# EasyEDA Pro project WirelessChargingReceive_V1.0.eprj

# Schematic WirelessChargingReceive
Create Date: 2023-05-12; Page Name: P1; Project Name: WirelessChargingReceive_V1.0; Schematic Name: WirelessChargingReceive; Update Date: 2023-05-12; Company: 嘉立创EDA; Page Size: A4; Version: V1.0
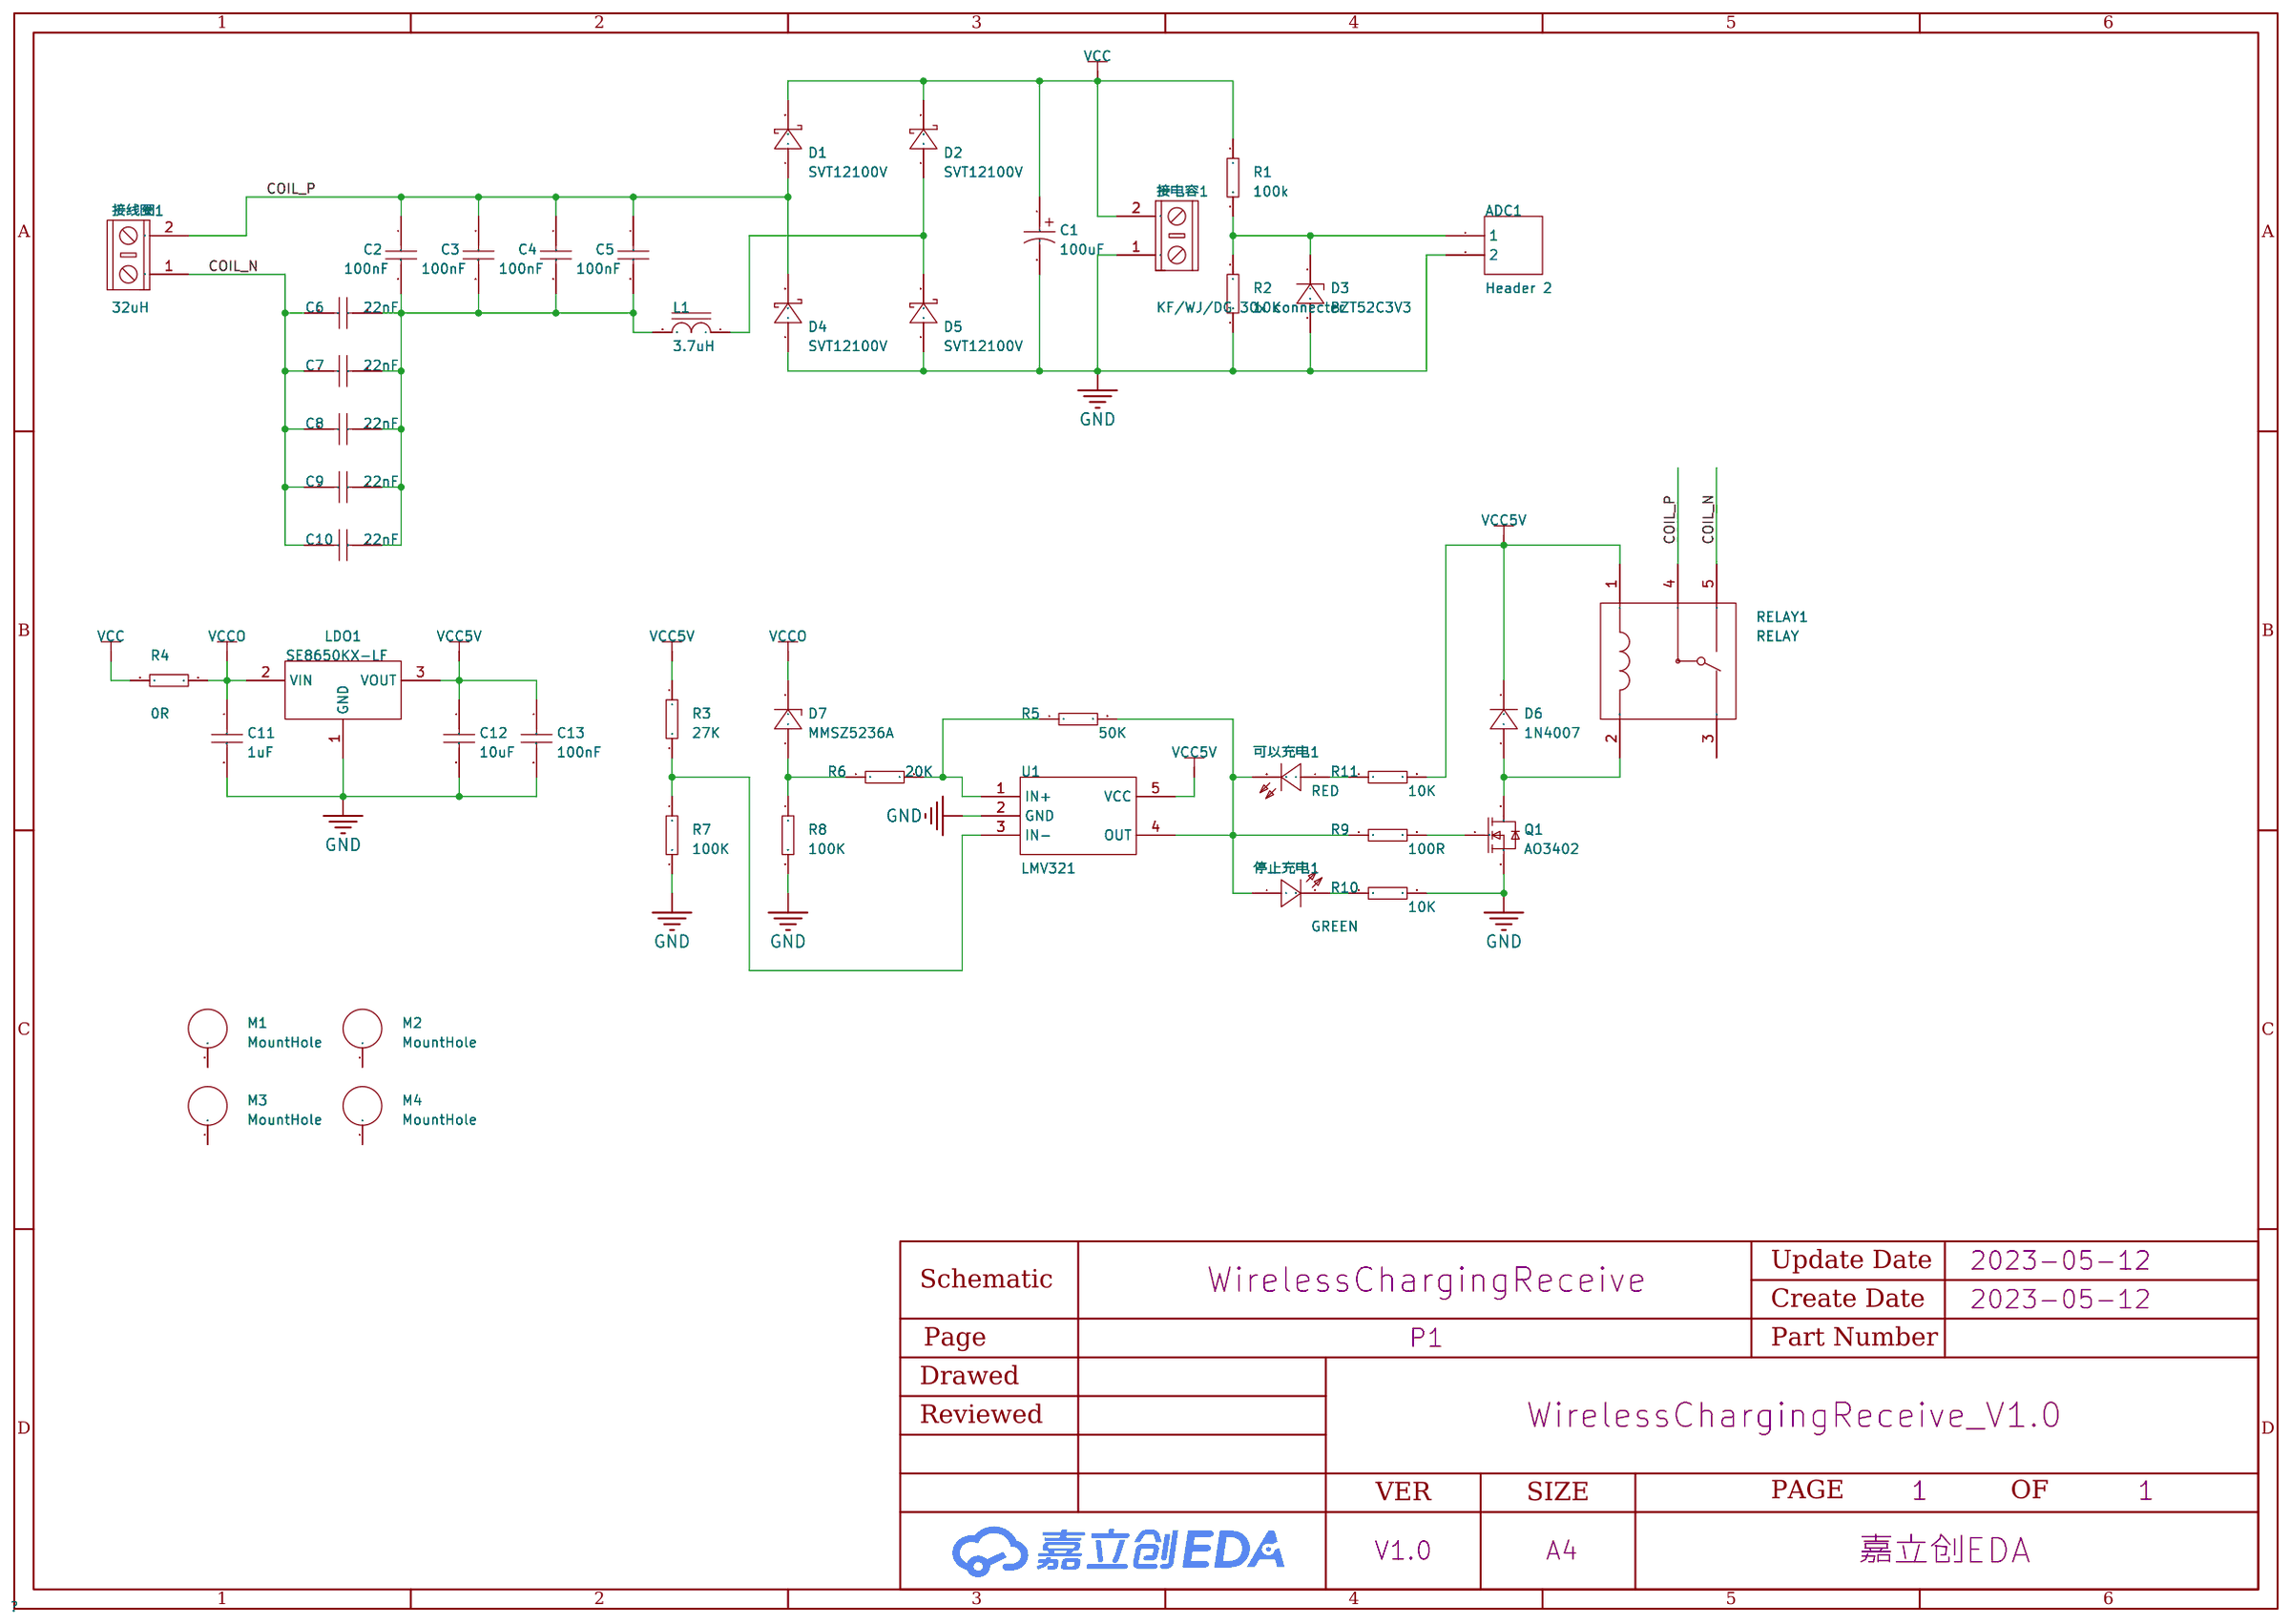
[diagram p0: schematic sheet]

## Parts
ADC1  Header 2  [HDR1X2]
C1  100uF  [CAPPR5-10X16]
C2  100nF  [CAPC3216[1206]S]
C3  100nF  [CAPC3216[1206]S]
C4  100nF  [CAPC3216[1206]S]
C5  100nF  [CAPC3216[1206]S]
C6  22nF  [CAPC3216[1206]S]
C7  22nF  [CAPC3216[1206]S]
C8  22nF  [CAPC3216[1206]S]
C9  22nF  [CAPC3216[1206]S]
C10  22nF  [CAPC3216[1206]S]
C11  1uF  [CAPC3216[1206]]
C12  10uF  [CAPC3216[1206]]
C13  100nF  [CAPC1608[0603]S-N]
D1  SVT12100V  [TO-277B]
D2  SVT12100V  [TO-277B]
D3  BZT52C3V3  [SOD-123-L]
D4  SVT12100V  [TO-277B]
D5  SVT12100V  [TO-277B]
D6  1N4007  [SOD-123-L]
D7  MMSZ5236A  [SOD-123-L]
L1  3.7uH  [T106-LAY]
LDO1  SE8650KX-LF  [SOT-89[T0243AA][SC62]]
M1  MountHole  [M3-MountHole-Plated]
M2  MountHole  [M3-MountHole-Plated]
M3  MountHole  [M3-MountHole-Plated]
M4  MountHole  [M3-MountHole-Plated]
Q1  AO3402  [SOT-23]
R1  100K  [RESC1608[0603]S-N]
R2  10K  [RESC1608[0603]S-N]
R3  27K  [RESC1608[0603]S-N]
R4  0R  [RESC1608[0603]S-N]
R5  50K  [RESC1608[0603]S-N]
R6  20K  [RESC1608[0603]S-N]
R7  100K  [RESC1608[0603]S-N]
R8  100K  [RESC1608[0603]S-N]
R9  100R  [RESC1608[0603]S-N]
R10  10K  [RESC1608[0603]S-N]
R11  10K  [RESC1608[0603]S-N]
RELAY1  RELAY  [RELAY-15x10x12]
U1  LMV321  [SOT-23-5]
停止充电1  GREEN  [LEDC1608(0603)-L]
可以充电1  RED  [LEDC1608(0603)-L]
接电容1  KF/WJ/DG 30x connecter  [KF/WJ/DG 301-2p-5.0mm]
接线圈1  32uH  [KF/WJ/DG 301-2p-5.0mm]

## Library data of the parts
ADC1 = Header 2: LatestRevisionDate: 17-Jul-2002; LatestRevisionNote: Re-released for DXP Platform.; Publisher: Altium Limited; Price(RMB): 0.00; Origin Footprint 2: PH2.0-2; Origin Footprint 3: XH2.54-2; Origin Footprint 4: GH1.25T-2P; Origin Footprint 5: XH2.54-2-L; Origin Footprint 6: XH2.54-WS-2P
C1 = Cap-Elect: Published: 8-Jun-2000; Revision: July-2002: Re-released for DXP Platform.; Publisher: Altium Limited; Price(RMB): 0.000; Voltage: 100V; Origin Footprint 2: CAPPR2-4x6.8; Origin Footprint 3: CAPPR2-5X5; Origin Footprint 4: CAPPR2-5X6.8; Origin Footprint 5: CAPPR2-5X7; Origin Footprint 6: CAPPR2-5X11; Origin Footprint 7: CAPPR2-5X11.5; Origin Footprint 8: CAPPR2-5X15; Origin Footprint 9: CAPPR2.5-6.3X5; Origin Footprint 10: CAPPR2.5-6.3X5/h.9; Origin Footprint 11: CAPPR2.5-6.3X6.8; Origin Footprint 12: CAPPR2.5-6.3X6.8/h.9; Origin Footprint 13: CAPPR2.5-6.3X7; Origin Footprint 14: CAPPR2.5-6.3X11; Origin Footprint 15: CAPPR2.5-6.3X11.5; Origin Footprint 16: CAPPR2.5-6.3X15; Origin Footprint 17: CAPPR2.5-6.3x9.8; Origin Footprint 18: CAPPR2.5-8X9.8; Origin Footprint 19: CAPPR2.5-8X11; Origin Footprint 20: CAPPR2.5-8x5; Origin Footprint 21: CAPPR3.05-3.81X6.35; Origin Footprint 22: CAPPR3.5-8X5/h.9; Origin Footprint 23: CAPPR3.5-8X10.5; Origin Footprint 24: CAPPR3.5-8X11.5; Origin Footprint 25: CAPPR3.5-8X12; Origin Footprint 26: CAPPR3.5-8X15; Origin Footprint 27: CAPPR3.5-8X20; Origin Footprint 28: CAPPR3.5-8x5; Origin Footprint 29: CAPPR5-8X5; Origin Footprint 30: CAPPR5-8X11.5; Origin Footprint 31: CAPPR5-8X12; Origin Footprint 32: CAPPR5-8X15; Origin Footprint 33: CAPPR5-8X20; Origin Footprint 34: CAPPR5-10X5/H.9; Origin Footprint 35: CAPPR5-10X10.5; Origin Footprint 36: CAPPR5-10X12.5; Origin Footprint 37: CAPPR5-10X20/H1.1; Origin Footprint 38: CAPPR5-10X25; Origin Footprint 39: CAPPR5-10X30; Origin Footprint 40: CAPPR5-10x5; Origin Footprint 41: CAPPR5-10x20; Origin Footprint 42: CAPPR2.5-6.3X6.8-L; Origin Footprint 43: CAPPR7.5-16X31.5; Origin Footprint 44: CAPPR7.5-16x25; Origin Footprint 45: CAPPR7.5-18x35.5
C2-C5 = Cap-Chip_1: Published: 2020-12-18; Revision: V1.1; Tolerance: ±10%; Voltage: 100V; Origin Footprint 2: CAPC1310[0504]S; Origin Footprint 3: CAPC3225[1210]S; Origin Footprint 4: CAPC4532[1812]S; Origin Footprint 5: CAPC4564[1825]S; Origin Footprint 6: CAPC2012[0805]; Origin Footprint 7: CAPC3216[1206]; Origin Footprint 8: CAPC3225[1210]; Origin Footprint 9: CAPC4532[1812]; Origin Footprint 10: CAPC4564[1825]; Origin Footprint 11: CAPC1608[0603]-N; Origin Footprint 12: CAPC1608[0603]-L; Origin Footprint 13: CAPC1608[0603]-M; Origin Footprint 14: CAPC1608[0603]S-L; Origin Footprint 15: CAPC1608[0603]S-M; Origin Footprint 16: CAPC1608[0603]S-N; Origin Footprint 17: CAPC1005[0402]-L; Origin Footprint 18: CAPC1005[0402]-M; Origin Footprint 19: CAPC1005[0402]-N; Origin Footprint 20: CAPC1005[0402]S-L; Origin Footprint 21: CAPC1005[0402]S-M; Origin Footprint 22: CAPC1005[0402]S-N; Origin Footprint 23: CAPC2012[0805]S-L; Origin Footprint 24: CAPC2012[0805]S-M; Origin Footprint 25: CAPC2012[0805]S-N
C6-C10 = Cap-Chip: Published: 2020-12-18; Revision: V1.1; Tolerance: ±10%; Voltage: 100V; Origin Footprint 2: CAPC1310[0504]S; Origin Footprint 3: CAPC3225[1210]S; Origin Footprint 4: CAPC4532[1812]S; Origin Footprint 5: CAPC4564[1825]S; Origin Footprint 6: CAPC2012[0805]; Origin Footprint 7: CAPC3216[1206]; Origin Footprint 8: CAPC3225[1210]; Origin Footprint 9: CAPC4532[1812]; Origin Footprint 10: CAPC4564[1825]; Origin Footprint 11: CAPC1608[0603]-N; Origin Footprint 12: CAPC1608[0603]-L; Origin Footprint 13: CAPC1608[0603]-M; Origin Footprint 14: CAPC1608[0603]S-L; Origin Footprint 15: CAPC1608[0603]S-M; Origin Footprint 16: CAPC1608[0603]S-N; Origin Footprint 17: CAPC1005[0402]-L; Origin Footprint 18: CAPC1005[0402]-M; Origin Footprint 19: CAPC1005[0402]-N; Origin Footprint 20: CAPC1005[0402]S-L; Origin Footprint 21: CAPC1005[0402]S-M; Origin Footprint 22: CAPC1005[0402]S-N; Origin Footprint 23: CAPC2012[0805]S-L; Origin Footprint 24: CAPC2012[0805]S-M; Origin Footprint 25: CAPC2012[0805]S-N
C11 = Cap-Chip_2: Published: 2020-12-18; Revision: V1.1; Tolerance: ±10%; Voltage: 100V; Origin Footprint 2: CAPC1310[0504]S; Origin Footprint 3: CAPC3216[1206]S; Origin Footprint 4: CAPC3225[1210]S; Origin Footprint 5: CAPC4532[1812]S; Origin Footprint 6: CAPC4564[1825]S; Origin Footprint 7: CAPC2012[0805]; Origin Footprint 8: CAPC3225[1210]; Origin Footprint 9: CAPC4532[1812]; Origin Footprint 10: CAPC4564[1825]; Origin Footprint 11: CAPC1608[0603]-N; Origin Footprint 12: CAPC1608[0603]-L; Origin Footprint 13: CAPC1608[0603]-M; Origin Footprint 14: CAPC1608[0603]S-L; Origin Footprint 15: CAPC1608[0603]S-M; Origin Footprint 16: CAPC1608[0603]S-N; Origin Footprint 17: CAPC1005[0402]-L; Origin Footprint 18: CAPC1005[0402]-M; Origin Footprint 19: CAPC1005[0402]-N; Origin Footprint 20: CAPC1005[0402]S-L; Origin Footprint 21: CAPC1005[0402]S-M; Origin Footprint 22: CAPC1005[0402]S-N; Origin Footprint 23: CAPC2012[0805]S-L; Origin Footprint 24: CAPC2012[0805]S-M; Origin Footprint 25: CAPC2012[0805]S-N
C12 = Cap-Chip_3: Published: 2020-12-18; Revision: V1.1; Tolerance: ±10%; Voltage: 25V; Origin Footprint 2: CAPC1310[0504]S; Origin Footprint 3: CAPC3216[1206]S; Origin Footprint 4: CAPC3225[1210]S; Origin Footprint 5: CAPC4532[1812]S; Origin Footprint 6: CAPC4564[1825]S; Origin Footprint 7: CAPC2012[0805]; Origin Footprint 8: CAPC3225[1210]; Origin Footprint 9: CAPC4532[1812]; Origin Footprint 10: CAPC4564[1825]; Origin Footprint 11: CAPC1608[0603]-N; Origin Footprint 12: CAPC1608[0603]-L; Origin Footprint 13: CAPC1608[0603]-M; Origin Footprint 14: CAPC1608[0603]S-L; Origin Footprint 15: CAPC1608[0603]S-M; Origin Footprint 16: CAPC1608[0603]S-N; Origin Footprint 17: CAPC1005[0402]-L; Origin Footprint 18: CAPC1005[0402]-M; Origin Footprint 19: CAPC1005[0402]-N; Origin Footprint 20: CAPC1005[0402]S-L; Origin Footprint 21: CAPC1005[0402]S-M; Origin Footprint 22: CAPC1005[0402]S-N; Origin Footprint 23: CAPC2012[0805]S-L; Origin Footprint 24: CAPC2012[0805]S-M; Origin Footprint 25: CAPC2012[0805]S-N
C13 = Cap-Chip_4: Published: 2020-12-18; Revision: V1.1; Tolerance: ±10%; Voltage: 50V; Origin Footprint 2: CAPC1310[0504]S; Origin Footprint 3: CAPC3216[1206]S; Origin Footprint 4: CAPC3225[1210]S; Origin Footprint 5: CAPC4532[1812]S; Origin Footprint 6: CAPC4564[1825]S; Origin Footprint 7: CAPC2012[0805]; Origin Footprint 8: CAPC3216[1206]; Origin Footprint 9: CAPC3225[1210]; Origin Footprint 10: CAPC4532[1812]; Origin Footprint 11: CAPC4564[1825]; Origin Footprint 12: CAPC1608[0603]-N; Origin Footprint 13: CAPC1608[0603]-L; Origin Footprint 14: CAPC1608[0603]-M; Origin Footprint 15: CAPC1608[0603]S-L; Origin Footprint 16: CAPC1608[0603]S-M; Origin Footprint 17: CAPC1005[0402]-L; Origin Footprint 18: CAPC1005[0402]-M; Origin Footprint 19: CAPC1005[0402]-N; Origin Footprint 20: CAPC1005[0402]S-L; Origin Footprint 21: CAPC1005[0402]S-M; Origin Footprint 22: CAPC1005[0402]S-N; Origin Footprint 23: CAPC2012[0805]S-L; Origin Footprint 24: CAPC2012[0805]S-M; Origin Footprint 25: CAPC2012[0805]S-N
D1 D2 D4 D5 = FM10U100: Revision: V1.0.0
D3 = Diode Zen: Published: 8-Jun-2000; Revision: July-2002: Re-released for DXP Platform.; Publisher: Altium Limited; Price(RMB): 0.000; Origin Footprint 2: DIODE-0.7; Origin Footprint 3: DIODE-0.4; Origin Footprint 4: SOD-87[LL-41]; Origin Footprint 5: CD4521-1808; Origin Footprint 6: SOD-80[LL-34]; Origin Footprint 7: SOD-123-FL; Origin Footprint 8: SOD-123-M; Origin Footprint 9: SOD-323; Origin Footprint 10: SOD-523-L; Origin Footprint 11: SOD-523-M
D6 = Diode: Published: 8-Jun-2000; Revision: July-2002: Re-released for DXP Platform.; Publisher: Altium Limited; Price(RMB): 0.000; Imax: 500mA; Origin Footprint 2: SMB[DO-214AA]; Origin Footprint 3: SMC[DO-214AB]; Origin Footprint 4: SMA[DO-214AC]; Origin Footprint 5: SOD-123-FL; Origin Footprint 6: SOD-123-M; Origin Footprint 7: SOD-323; Origin Footprint 8: SOD-523-L; Origin Footprint 9: SOD-523-M
D7 = Diode Zen_1: Published: 8-Jun-2000; Revision: July-2002: Re-released for DXP Platform.; Publisher: Altium Limited; Price(RMB): 0.000; Origin Footprint 2: DIODE-0.7; Origin Footprint 3: DIODE-0.4; Origin Footprint 4: SOD-87[LL-41]; Origin Footprint 5: CD4521-1808; Origin Footprint 6: SOD-80[LL-34]; Origin Footprint 7: SOD-123-FL; Origin Footprint 8: SOD-123-M; Origin Footprint 9: SOD-323; Origin Footprint 10: SOD-523-L; Origin Footprint 11: SOD-523-M
L1 = Ind-Power: Published: 8-Jun-2000; Revision: July-2002: Re-released for DXP Platform.; Publisher: Altium Limited; Imax: 50mA; DCR: .5m; Price(RMB): 0.000; Origin Footprint 2: CD31; Origin Footprint 3: CD32; Origin Footprint 4: CD42; Origin Footprint 5: CD43; Origin Footprint 6: CD52; Origin Footprint 7: CD53; Origin Footprint 8: CD54; Origin Footprint 9: CD73; Origin Footprint 10: CD75; Origin Footprint 11: CD104; Origin Footprint 12: CD105; Origin Footprint 13: CD106; Origin Footprint 14: 127 Shielded 12.5*12.5*7; Origin Footprint 15: 0630 TPC 7*7*3; Origin Footprint 16: 1050 TPC 10*10*5; Origin Footprint 17: 1265 TPC 12*12*6.5; Origin Footprint 18: CD104R; Origin Footprint 19: SLO2520; Origin Footprint 20: 1365 TPC 13*13*6.5; Origin Footprint 21: INDUCTOR; Origin Footprint 22: T94-LAY
LDO1 = SE86XXKX-LF
M1-M4 = MountHole: Origin Footprint 2: M3-MountHole; Origin Footprint 3: M3-MountSlot; Origin Footprint 4: M3-MountSlot-Plated; Origin Footprint 5: M3-MountHole-4mm; Origin Footprint 6: M3-MountHole-5mm; Origin Footprint 7: M3-MountHole-6mm; Origin Footprint 8: M3-MountHole-7mm; Origin Footprint 9: M3-MountHole-8mm; Origin Footprint 10: M3-MountHole-9mm; Origin Footprint 11: M3-MountHole-10mm; Origin Footprint 12: M3-MountHole-11mm; Origin Footprint 13: M3-MountHole-12mm; Origin Footprint 14: M3-MountHole-13mm; Origin Footprint 15: M3-MountHole-14mm; Origin Footprint 16: M3-MountHole-15mm; Origin Footprint 17: M3-MountHole-16mm; Origin Footprint 18: M3-MountHole-17mm; Origin Footprint 19: M3-MountHole-18mm; Origin Footprint 20: M3-MountHole-19mm; Origin Footprint 21: M3-MountHole-20mm; Origin Footprint 22: M3-MountHole-Plated-4MM; Origin Footprint 23: M3-MountHole-Plated-5MM; Origin Footprint 24: M3-MountHole-Plated-6MM; Origin Footprint 25: M3-MountHole-Plated-7MM; Origin Footprint 26: M3-MountHole-Plated-8MM; Origin Footprint 27: M3-MountHole-Plated-9MM; Origin Footprint 28: M3-MountHole-Plated-10MM; Origin Footprint 29: M3-MountHole-Plated-11MM; Origin Footprint 30: M3-MountHole-Plated-12MM; Origin Footprint 31: M3-MountHole-Plated-13MM; Origin Footprint 32: M3-MountHole-Plated-14MM; Origin Footprint 33: M3-MountHole-Plated-15MM; Origin Footprint 34: M3-MountHole-Plated-16MM; Origin Footprint 35: M3-MountHole-Plated-17MM; Origin Footprint 36: M3-MountHole-Plated-18MM; Origin Footprint 37: M3-MountHole-Plated-19MM; Origin Footprint 38: M3-MountHole-Plated-20MM
Q1 = AO3400
R1 R7 R8 = Res-Chip: Published: 8-Jun-2000; Revision: July-2002: Re-released for DXP Platform.; Tolerance: ±1%; Origin Footprint 2: RESC3225[1210]S; Origin Footprint 3: RESC5025[2010]S; Origin Footprint 4: RESC6332[2512]S; Origin Footprint 5: RESC5025[2010]; Origin Footprint 6: RESC6332[2512]; Origin Footprint 7: RESC3225[1210]; Origin Footprint 8: RESC3216[1206]; Origin Footprint 9: RESC2012[0805]; Origin Footprint 10: RESC1608[0603]-M; Origin Footprint 11: RESC1608[0603]-L; Origin Footprint 12: RESC1608[0603]-N; Origin Footprint 13: RESC1608[0603]S-L; Origin Footprint 14: RESC1608[0603]S-M; Origin Footprint 15: RESC1005[0402]-L; Origin Footprint 16: RESC1005[0402]-N; Origin Footprint 17: RESC1005[0402]-M; Origin Footprint 18: RESC1005[0402]S-L; Origin Footprint 19: RESC1005[0402]S-M; Origin Footprint 20: RESC1005[0402]S-N; Origin Footprint 21: RESC2012[0805]S-L; Origin Footprint 22: RESC2012[0805]S-M; Origin Footprint 23: RESC2012[0805]S-N; Origin Footprint 24: RESC3216[1206]S-L; Origin Footprint 25: RESC3216[1206]S-M; Origin Footprint 26: RESC3216[1206]S-N
R2 R10 R11 = Res-Chip_1: Published: 8-Jun-2000; Revision: July-2002: Re-released for DXP Platform.; Tolerance: ±1%; Origin Footprint 2: RESC3225[1210]S; Origin Footprint 3: RESC5025[2010]S; Origin Footprint 4: RESC6332[2512]S; Origin Footprint 5: RESC5025[2010]; Origin Footprint 6: RESC6332[2512]; Origin Footprint 7: RESC3225[1210]; Origin Footprint 8: RESC3216[1206]; Origin Footprint 9: RESC2012[0805]; Origin Footprint 10: RESC1608[0603]-M; Origin Footprint 11: RESC1608[0603]-L; Origin Footprint 12: RESC1608[0603]-N; Origin Footprint 13: RESC1608[0603]S-L; Origin Footprint 14: RESC1608[0603]S-M; Origin Footprint 15: RESC1005[0402]-L; Origin Footprint 16: RESC1005[0402]-N; Origin Footprint 17: RESC1005[0402]-M; Origin Footprint 18: RESC1005[0402]S-L; Origin Footprint 19: RESC1005[0402]S-M; Origin Footprint 20: RESC1005[0402]S-N; Origin Footprint 21: RESC2012[0805]S-L; Origin Footprint 22: RESC2012[0805]S-M; Origin Footprint 23: RESC2012[0805]S-N; Origin Footprint 24: RESC3216[1206]S-L; Origin Footprint 25: RESC3216[1206]S-M; Origin Footprint 26: RESC3216[1206]S-N
R3 = Res-Chip_4: Published: 8-Jun-2000; Revision: July-2002: Re-released for DXP Platform.; Tolerance: ±1%; Origin Footprint 2: RESC3225[1210]S; Origin Footprint 3: RESC5025[2010]S; Origin Footprint 4: RESC6332[2512]S; Origin Footprint 5: RESC5025[2010]; Origin Footprint 6: RESC6332[2512]; Origin Footprint 7: RESC3225[1210]; Origin Footprint 8: RESC3216[1206]; Origin Footprint 9: RESC2012[0805]; Origin Footprint 10: RESC1608[0603]-M; Origin Footprint 11: RESC1608[0603]-L; Origin Footprint 12: RESC1608[0603]-N; Origin Footprint 13: RESC1608[0603]S-L; Origin Footprint 14: RESC1608[0603]S-M; Origin Footprint 15: RESC1005[0402]-L; Origin Footprint 16: RESC1005[0402]-N; Origin Footprint 17: RESC1005[0402]-M; Origin Footprint 18: RESC1005[0402]S-L; Origin Footprint 19: RESC1005[0402]S-M; Origin Footprint 20: RESC1005[0402]S-N; Origin Footprint 21: RESC2012[0805]S-L; Origin Footprint 22: RESC2012[0805]S-M; Origin Footprint 23: RESC2012[0805]S-N; Origin Footprint 24: RESC3216[1206]S-L; Origin Footprint 25: RESC3216[1206]S-M; Origin Footprint 26: RESC3216[1206]S-N
R4 = Res-Chip_6: Published: 8-Jun-2000; Revision: July-2002: Re-released for DXP Platform.; Tolerance: ±1%; Origin Footprint 2: RESC3225[1210]S; Origin Footprint 3: RESC5025[2010]S; Origin Footprint 4: RESC6332[2512]S; Origin Footprint 5: RESC5025[2010]; Origin Footprint 6: RESC6332[2512]; Origin Footprint 7: RESC3225[1210]; Origin Footprint 8: RESC3216[1206]; Origin Footprint 9: RESC2012[0805]; Origin Footprint 10: RESC1608[0603]-M; Origin Footprint 11: RESC1608[0603]-L; Origin Footprint 12: RESC1608[0603]-N; Origin Footprint 13: RESC1608[0603]S-L; Origin Footprint 14: RESC1608[0603]S-M; Origin Footprint 15: RESC1005[0402]-L; Origin Footprint 16: RESC1005[0402]-N; Origin Footprint 17: RESC1005[0402]-M; Origin Footprint 18: RESC1005[0402]S-L; Origin Footprint 19: RESC1005[0402]S-M; Origin Footprint 20: RESC1005[0402]S-N; Origin Footprint 21: RESC2012[0805]S-L; Origin Footprint 22: RESC2012[0805]S-M; Origin Footprint 23: RESC2012[0805]S-N; Origin Footprint 24: RESC3216[1206]S-L; Origin Footprint 25: RESC3216[1206]S-M; Origin Footprint 26: RESC3216[1206]S-N
R5 = Res-Chip_3: Published: 8-Jun-2000; Revision: July-2002: Re-released for DXP Platform.; Tolerance: ±1%; Origin Footprint 2: RESC3225[1210]S; Origin Footprint 3: RESC5025[2010]S; Origin Footprint 4: RESC6332[2512]S; Origin Footprint 5: RESC5025[2010]; Origin Footprint 6: RESC6332[2512]; Origin Footprint 7: RESC3225[1210]; Origin Footprint 8: RESC3216[1206]; Origin Footprint 9: RESC2012[0805]; Origin Footprint 10: RESC1608[0603]-M; Origin Footprint 11: RESC1608[0603]-L; Origin Footprint 12: RESC1608[0603]-N; Origin Footprint 13: RESC1608[0603]S-L; Origin Footprint 14: RESC1608[0603]S-M; Origin Footprint 15: RESC1005[0402]-L; Origin Footprint 16: RESC1005[0402]-N; Origin Footprint 17: RESC1005[0402]-M; Origin Footprint 18: RESC1005[0402]S-L; Origin Footprint 19: RESC1005[0402]S-M; Origin Footprint 20: RESC1005[0402]S-N; Origin Footprint 21: RESC2012[0805]S-L; Origin Footprint 22: RESC2012[0805]S-M; Origin Footprint 23: RESC2012[0805]S-N; Origin Footprint 24: RESC3216[1206]S-L; Origin Footprint 25: RESC3216[1206]S-M; Origin Footprint 26: RESC3216[1206]S-N
R6 = Res-Chip_2: Published: 8-Jun-2000; Revision: July-2002: Re-released for DXP Platform.; Tolerance: ±1%; Origin Footprint 2: RESC3225[1210]S; Origin Footprint 3: RESC5025[2010]S; Origin Footprint 4: RESC6332[2512]S; Origin Footprint 5: RESC5025[2010]; Origin Footprint 6: RESC6332[2512]; Origin Footprint 7: RESC3225[1210]; Origin Footprint 8: RESC3216[1206]; Origin Footprint 9: RESC2012[0805]; Origin Footprint 10: RESC1608[0603]-M; Origin Footprint 11: RESC1608[0603]-L; Origin Footprint 12: RESC1608[0603]-N; Origin Footprint 13: RESC1608[0603]S-L; Origin Footprint 14: RESC1608[0603]S-M; Origin Footprint 15: RESC1005[0402]-L; Origin Footprint 16: RESC1005[0402]-N; Origin Footprint 17: RESC1005[0402]-M; Origin Footprint 18: RESC1005[0402]S-L; Origin Footprint 19: RESC1005[0402]S-M; Origin Footprint 20: RESC1005[0402]S-N; Origin Footprint 21: RESC2012[0805]S-L; Origin Footprint 22: RESC2012[0805]S-M; Origin Footprint 23: RESC2012[0805]S-N; Origin Footprint 24: RESC3216[1206]S-L; Origin Footprint 25: RESC3216[1206]S-M; Origin Footprint 26: RESC3216[1206]S-N
R9 = Res-Chip_5: Published: 8-Jun-2000; Revision: July-2002: Re-released for DXP Platform.; Tolerance: ±1%; Origin Footprint 2: RESC3225[1210]S; Origin Footprint 3: RESC5025[2010]S; Origin Footprint 4: RESC6332[2512]S; Origin Footprint 5: RESC5025[2010]; Origin Footprint 6: RESC6332[2512]; Origin Footprint 7: RESC3225[1210]; Origin Footprint 8: RESC3216[1206]; Origin Footprint 9: RESC2012[0805]; Origin Footprint 10: RESC1608[0603]-M; Origin Footprint 11: RESC1608[0603]-L; Origin Footprint 12: RESC1608[0603]-N; Origin Footprint 13: RESC1608[0603]S-L; Origin Footprint 14: RESC1608[0603]S-M; Origin Footprint 15: RESC1005[0402]-L; Origin Footprint 16: RESC1005[0402]-N; Origin Footprint 17: RESC1005[0402]-M; Origin Footprint 18: RESC1005[0402]S-L; Origin Footprint 19: RESC1005[0402]S-M; Origin Footprint 20: RESC1005[0402]S-N; Origin Footprint 21: RESC2012[0805]S-L; Origin Footprint 22: RESC2012[0805]S-M; Origin Footprint 23: RESC2012[0805]S-N; Origin Footprint 24: RESC3216[1206]S-L; Origin Footprint 25: RESC3216[1206]S-M; Origin Footprint 26: RESC3216[1206]S-N
RELAY1 = RELAY: Origin Footprint 2: RELAY-19x16x16
U1 = LM321
停止充电1 = LED Chip Green: Published: 8-Jun-2000; Revision: July-2002: Re-released for DXP Platform.; Publisher: Altium Limited; Price(RMB): 0.00; Origin Footprint 2: LEDC1608(0603); Origin Footprint 3: LEDC2012(0805); Origin Footprint 4: LEDC3216(1206); Origin Footprint 5: LEDC2012(0805)-L; Origin Footprint 6: LEDC3216(1204); Origin Footprint 7: LEDC3528-2
可以充电1 = LED Chip Red: Published: 8-Jun-2000; Revision: July-2002: Re-released for DXP Platform.; Publisher: Altium Limited; Price(RMB): 0.00; Origin Footprint 2: LEDC1608(0603); Origin Footprint 3: LEDC2012(0805); Origin Footprint 4: LEDC3216(1206); Origin Footprint 5: LEDC2012(0805)-L; Origin Footprint 6: LEDC3216(1204); Origin Footprint 7: LEDC3528-2
接电容1 接线圈1 = KF/WJ/DG 30x

## Nets
GND: ADC1.2 C1.2 C11.2 C12.2 C13.2 D3.A D4.1 D5.1 LDO1.1(GND) Q1.2(S) R2.2 R7.2 R8.2 R10.2 U1.2(GND) 接电容1.1
VCC: C1.1 D1.2 D2.2 R1.1 R4.1 接电容1.2
VCC5V: C12.1 C13.1 D6.K LDO1.3(VOUT) R3.1 R11.2 RELAY1.1 U1.5(VCC)
VCCO: C11.1 D7.K LDO1.2(VIN) R4.2
COIL_N: C6.1 C7.1 C8.1 C9.1 C10.1 RELAY1.5 接线圈1.1
COIL_P: C2.1 C3.1 C4.1 C5.1 D1.1 D4.2 RELAY1.4 接线圈1.2
$1N2840: D7.A R6.1 R8.1
$1N3019: R3.2 R7.1 U1.3(IN-)
$1N3054: R5.1 R6.2 U1.1(IN+)
$1N3707: Q1.1(G) R9.2
$1N4256: C2.2 C3.2 C4.2 C5.2 C6.2 C7.2 C8.2 C9.2 C10.2 L1.2
$1N4259: D2.1 D5.2 L1.1
Net-(ADC1-1): ADC1.1 D3.K R1.2 R2.1
Net-(D6-A): D6.A Q1.3(D) RELAY1.2
Net-(R5-2): R5.2 R9.1 U1.4(OUT) 停止充电1.A 可以充电1.C
Net-(R10-1): R10.1 停止充电1.C
Net-(R11-1): R11.1 可以充电1.A

Not connected (* = marked no-connect by the designer): M1 1; M2 1; M3 1; M4 1; RELAY1 3

# Board WirelessChargingReceive
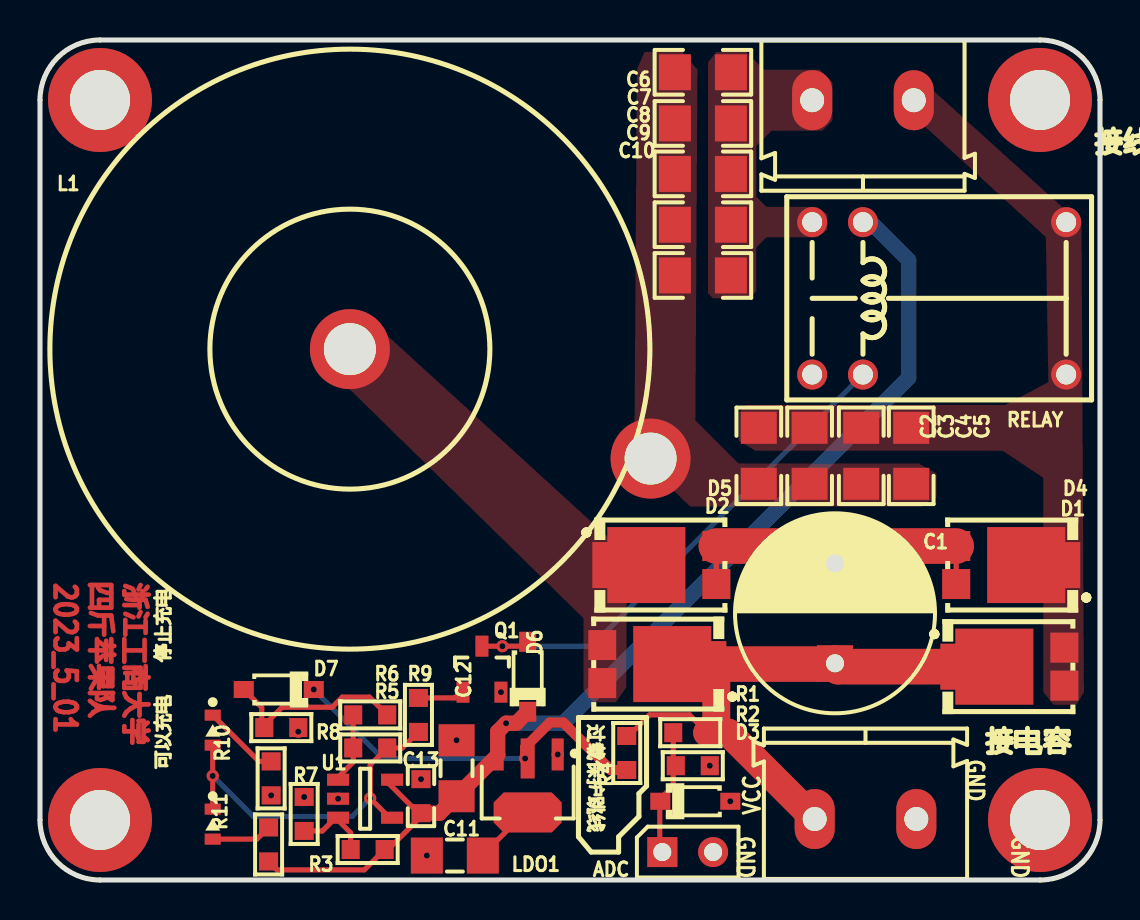
[diagram p1: board, top side]
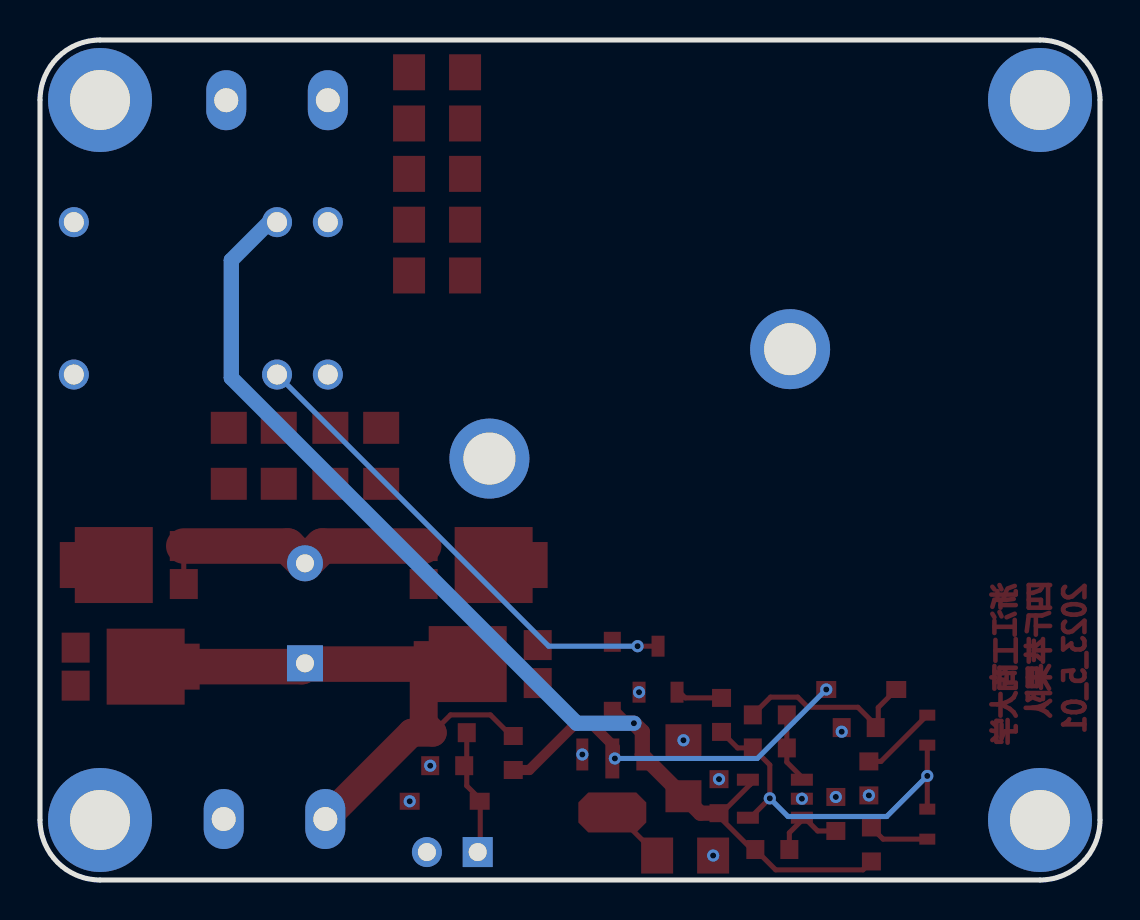
[diagram p2: board, bottom side, seen from below]

Outline 53 x 42 mm; copper layers: Top Layer, Bottom Layer. Coordinates in mm from the lower left corner of the outline.
Outline path: 0,39 0,3 arc(0.88,0.88) 3,0 50,0 arc(52.12,0.88) 53,3 53,39 arc(52.12,41.12) 50,42 3,42 arc(0.88,41.12) 0,39
Stack: Top Layer 0.035mm / Dielectric1 1.51mm FR4 er 4.5 / Bottom Layer 0.035mm

## Design rules (mm)
template: JLCPCB Capability(Two Layers Board)
spacing copperThickness1oz (default): track to track 0.102, other pairs 0.152 to 0.3
spacing copperThickness2oz: track to track 0.203, other pairs 0.152 to 0.3
track width copperThickness1oz (default): min 0.127, default 0.254, max 2.54
track width copperThickness2oz: min 0.203, default 0.254, max 2.54
differential pair differentialPair (default): width min 0.127, default 0.254, max 2.54; gap min 0.152, default 0.152
via viaSize (default): diameter min 0.5, default 0.61, max 10; hole min 0.3, default 0.305, max 6.3

## Placement (name value [footprint] x y rotation side)
ADC  Header 2  [HDR1X2]  31.12 1.4 0 top
C1  100uF  [CAPPR5-10X16]  39.75 13.33 90 top
C2  100nF  [CAPC3216[1206]S]  35.94 21.21 270 top
C3  100nF  [CAPC3216[1206]S]  38.48 21.21 270 top
C4  100nF  [CAPC3216[1206]S]  41.06 21.21 270 top
C5  100nF  [CAPC3216[1206]S]  43.56 21.21 270 top
C6  22nF  [CAPC3216[1206]S]  33.15 40.39 180 top
C7  22nF  [CAPC3216[1206]S]  33.15 37.83 180 top
C8  22nF  [CAPC3216[1206]S]  33.15 35.31 180 top
C9  22nF  [CAPC3216[1206]S]  33.15 32.77 180 top
C10  22nF  [CAPC3216[1206]S]  33.15 30.23 180 top
C11  1uF  [CAPC3216[1206]]  20.74 1.22 180 top
C12  10uF  [CAPC3216[1206]]  20.83 5.59 90 top
C13  100nF  [CAPC1608[0603]S-N]  19.05 4.19 90 top
D1  SVT12100V  [TO-277B]  47.12 10.67 0 top
D2  SVT12100V  [TO-277B]  32.21 10.8 180 top
D3  BZT52C3V3  [SOD-123-L]  32.77 3.94 180 top
D4  SVT12100V  [TO-277B]  49.91 15.75 180 top
D5  SVT12100V  [TO-277B]  29.72 15.75 0 top
D6  1N4007  [SOD-123-L]  24.38 10.16 270 top
D7  MMSZ5236A  [SOD-123-L]  11.94 9.53 0 top
L1  3.7uH  [T106-LAY]  15.49 26.54 340 top
LDO1  SE8650KX-LF  [SOT-89[T0243AA][SC62]]  24.38 4.83 270 top
M1  MountHole  [M3-MountHole-Plated]  3 39 0 top
M2  MountHole  [M3-MountHole-Plated]  3 3 0 top
M3  MountHole  [M3-MountHole-Plated]  50 3 0 top
M4  MountHole  [M3-MountHole-Plated]  50 39 0 top
Q1  AO3402  [SOT-23]  22.1 10.54 90 top
R1  100K  [RESC1608[0603]S-N]  32.51 7.37 180 top
R2  10K  [RESC1608[0603]S-N]  32.64 5.72 0 top
R3  27K  [RESC1608[0603]S-N]  16.38 1.52 180 top
R4  0R  [RESC1608[0603]S-N]  29.34 6.35 270 top
R5  50K  [RESC1608[0603]S-N]  16.51 6.6 0 top
R6  20K  [RESC1608[0603]S-N]  16.51 8.25 180 top
R7  100K  [RESC1608[0603]S-N]  13.21 3.3 90 top
R8  100K  [RESC1608[0603]S-N]  12.06 7.62 0 top
R9  100R  [RESC1608[0603]S-N]  18.92 8.25 90 top
R10  10K  [RESC1608[0603]S-N]  11.56 5.08 270 top
R11  10K  [RESC1608[0603]S-N]  11.43 1.78 270 top
RELAY  RELAY  [RELAY-15x10x12]  44.96 29.08 0 top
U1  LMV321  [SOT-23-5]  16.26 4.06 0 top
停止充电  GREEN  [LEDC1608(0603)-L]  8.64 7.49 270 top
可以充电  RED  [LEDC1608(0603)-L]  8.64 2.79 270 top
接电容  KF/WJ/DG 30x connecter  [KF/WJ/DG 301-2p-5.0mm]  41.28 3.05 0 top
接线圈  32uH  [KF/WJ/DG 301-2p-5.0mm]  41.15 38.99 180 top

## Footprints (pads in the part's own frame, mm; a bottom-side part is the same pattern mirrored in y, then rotated)
CAPC1608[0603]S-N
  rect 0.9x0.95 smd: 1(-0.85,0) 2(0.85,0)
CAPC3216[1206]
  rect 1.6x1.8 smd: 1(-1.4,0) 2(1.4,0)
CAPC3216[1206]S
  rect 1.6x1.8 smd: 1(-1.4,0) 2(1.4,0)
CAPPR5-10X16
  rect 1.8x1.8 hole 0.9: 1(-2.5,0)
  round 1.8 hole 0.9: 2(2.5,0)
HDR1X2
  rect 1.5x1.5 hole 0.9: 1(0,0)
  round 1.5 hole 0.9: 2(2.54,0)
KF/WJ/DG 301-2p-5.0mm
  oval 2x3 hole 1.2: 1(2.54,0) 2(-2.54,0)
LEDC1608(0603)-L
  rect 0.55x0.8 smd: A(0.75,0) C(-0.75,0)
M3-MountHole-Plated
  round 5.2 hole 3: 1(0,0)
RELAY-15x10x12
  round 1.5 hole 1: 1(-3.81,3.81) 2(-3.81,-3.81) 3(-6.35,-3.81) 4(6.35,3.81) 4(6.35,-3.81) 5(-6.35,3.81)
RESC1608[0603]S-N
  rect 0.9x0.95 smd: 1(-0.85,0) 2(0.85,0)
SOD-123-L
  rect 1x0.85 smd: A(-1.75,0) K(1.75,0)
SOT-23
  rect 1.05x0.65 smd: 1(-1.15,0.95) 2(-1.15,-0.95) 3(1.15,0)
SOT-23-5
  rect 1.1x0.6 smd: 1(-1.35,0.95) 2(-1.35,0) 3(-1.35,-0.95) 4(1.35,-0.95) 5(1.35,0.95)
SOT-89[T0243AA][SC62]
  rect 1.6x0.6 smd: 1(-1.45,1.5) 3(-1.45,-1.5)
  rect 2x0.7 smd: 2(-1.25,0)
  custom 2x3.4 smd: 2(1.45,0)
T106-LAY
  round 4 hole 2.6: 1(0,0) 2(16,0)
TO-277B
  rect 1.4x1.5 smd: 1(4.1,0.95) 1(4.1,-0.95)
  rect 1x2.3 smd: 2(-1.6,0)
  rect 3.9x3.8 smd: 2(0.6,0)

## Nets
GND: ADC.2 C1.2 C11.2 C12.2 C13.2 D3.A D4.1 D5.1 LDO1.1 Q1.2 R2.2 R7.2 R8.2 R10.2 U1.2 接电容.1
VCC: C1.1 D1.2 D2.2 R1.1 R4.1 接电容.2
VCC5V: C12.1 C13.1 D6.K LDO1.3 R3.1 R11.2 RELAY.1 U1.5
VCCO: C11.1 D7.K LDO1.2 R4.2
COIL_N: C6.1 C7.1 C8.1 C9.1 C10.1 RELAY.5 接线圈.1
COIL_P: C2.1 C3.1 C4.1 C5.1 D1.1 D4.2 RELAY.4 接线圈.2
$1N1852: ADC.1 D3.K R1.2 R2.1
$1N2840: D7.A R6.1 R8.1
$1N3019: R3.2 R7.1 U1.3
$1N3054: R5.1 R6.2 U1.1
$1N3281: R5.2 R9.1 U1.4 停止充电.A 可以充电.C
$1N3296: R11.1 可以充电.A
$1N3299: R10.1 停止充电.C
$1N3707: Q1.1 R9.2
$1N3913: D6.A Q1.3 RELAY.2
$1N4256: C2.2 C3.2 C4.2 C5.2 C6.2 C7.2 C8.2 C9.2 C10.2 L1.2
$1N4259: D2.1 D5.2 L1.1

Pads without a net: M1 1; M2 1; M3 1; M4 1; RELAY 3

## Via types
v1: diameter 0.61, hole 0.305, Top Layer to Bottom Layer, 17 vias

## Routing (per net, layer and track width the routed paths; a pad name or vN(x,y) marks a point on that pad's centre or on a via; arc(x,y) is an arc through that point)
GND: length 16.5
  Top Layer w0.254: D4.1 D4.1 ; D5.1 D5.1
  Top Layer w1.778: D4.1 40.61,16.7 C1.2 38.89,16.7 D5.1
  vias: v1(11.56,4.23) v1(12.91,7.42) v1(13.21,4.15) v1(14.91,4.06) v1(19.05,5.04) v1(19.34,1.22) v1(20.83,6.99) v1(23.05,9.39) v1(25.88,6.28) v1(33.49,5.72) v1(34.52,3.94)
VCC: length 29.6
  Top Layer w0.254: R4.1 29.43,7.2 30.48,8.25 32.47,8.25 R1.1
  Top Layer w1.397: D2.2 33.81,7.82 R1.1 34.42,7.37 接电容.2
  Top Layer w1.778: D1.2 D1.2 39.92,10.67 C1.1 39.71,10.8 D2.2
VCC5V: length 55.6
  Top Layer w0.254: R11.2 11.85,0.51 16.22,0.51 R3.1 17.4,1.52 18.92,3.05 18.92,3.34 17.48,4.78 17.48,5.01
  Top Layer w0.762: D6.K 23.81,7.84 v1(23.3,7.84) 22.88,7.42 LDO1.3 22.88,6.24 C12.1 19.98,3.34 19.05,3.34
  Bottom Layer w0.762: v1(23.3,7.84) 26.16,7.84 43.43,25.11 43.43,30.99 41.53,32.89 RELAY.1
VCCO: length 22.3
  Top Layer w0.254: 24.26,3.38 22.1,1.22 22.02,1.22
  Top Layer w0.508: v1(24.26,6.08) 24.26,6.64 25.5,7.87 26.16,7.87 28.54,5.5 R4.2
  Bottom Layer w0.254: v1(24.26,6.08) 17.14,6.08 v1(13.69,9.53)
$1N1852: length 6.3
  Top Layer w0.254: 30.99,1.4 30.99,3.84 30.89,3.94 31.66,4.71 R1.2
$1N2840: length 9.5
  Top Layer w0.254: D7.A 11.09,8.62 11.09,7.62 12.1,8.64 14.6,8.64 15.11,9.14 16.47,9.14 R6.1
$1N3019: length 3.9
  Top Layer w0.254: 15.53,1.52 15.53,2.36 14.78,3.11 14.12,2.45 13.08,2.45
$1N3054: length 3.6
  Top Layer w0.254: R6.2 R5.1 15.66,5.89 14.78,5.01
$1N3281: length 18.4
  Top Layer w0.254: R9.1 18.12,6.6 R5.2 16.51,5.75 v1(16.51,4.08) 17.48,3.11 ; 停止充电.A v1(8.64,5.2) 可以充电.C
  Bottom Layer w0.254: v1(16.51,4.08) 15.6,3.17 10.66,3.17 v1(8.64,5.2)
$1N3296: length 3
  Top Layer w0.254: R11.1 10.85,2.04 可以充电.A
$1N3299: length 3.8
  Top Layer w0.254: 11.43,5.93 10.95,5.93 停止充电.C
$1N3707: length 2.2
  Top Layer w0.254: R9.2 20.74,9.11 21.02,9.39
$1N3913: length 26.2
  Top Layer w0.254: D6.A 24.16,11.69 v1(23.12,11.69) 21.97,11.69
  Bottom Layer w0.254: RELAY.2 27.57,11.69 v1(23.12,11.69)

## Copper pours and planes (outline as drawn; the poured copper is in the pictures)
GND on Bottom Layer: -0.76,43.94 55.63,43.94 55.63,-1.91 -0.76,-1.91
COIL_N on Top Layer: 33.4,41.4 39.62,41.4 39.62,29.08 33.4,29.08
COIL_P on Top Layer: 34.93,40.02 52.2,40.02 52.2,8.76 34.93,8.76
$1N4256 on Top Layer: 29.72,41.4 44.83,41.4 44.83,18.67 29.72,18.67
$1N4259 on Top Layer: 14.35,27.81 29.34,27.81 29.34,8.89 14.35,8.89

## Text on the board
Top Layer: 浙江工商大学 / 四斤苹果队 / 2023_5_01
Top Silkscreen Layer: VCC | GND | 过载保护跳线
